# Altium project yampad_v2.PrjPcb
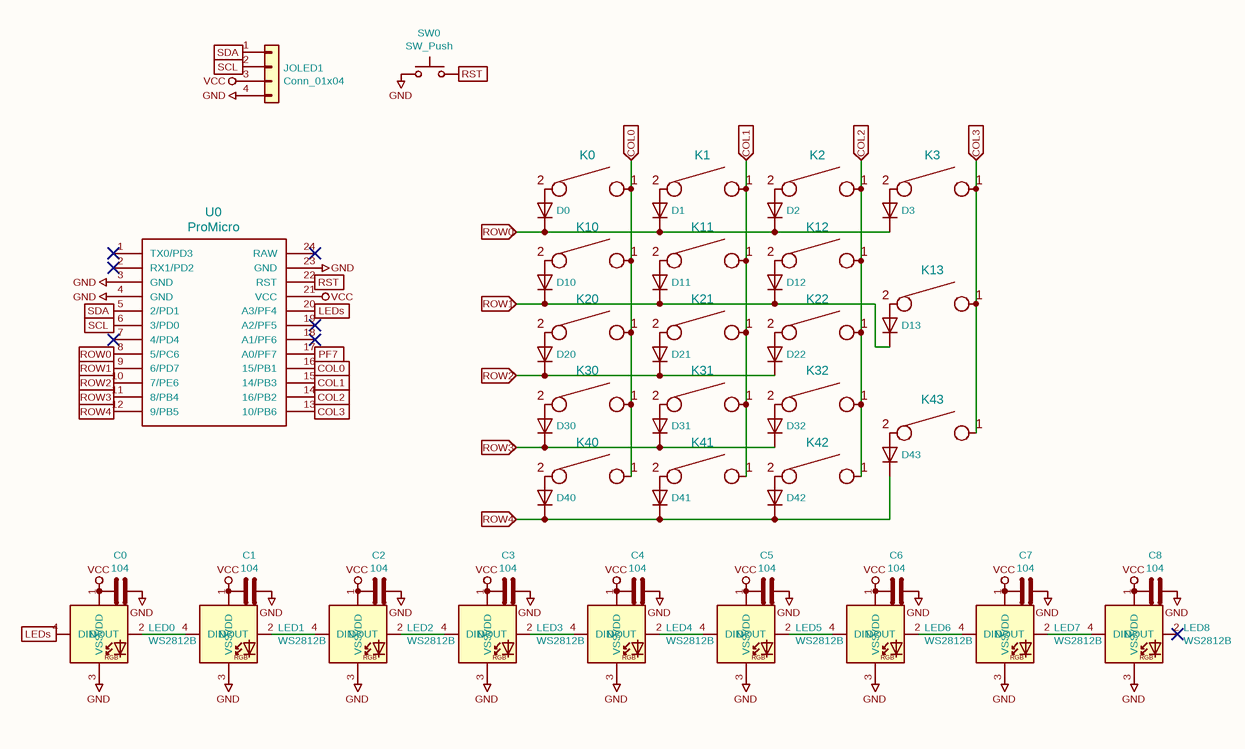
[diagram p0: yampad_v2.SchDoc]
1 sheet, 57 parts. Net scope: flat (ports and power ports of the same name join across sheets).
Board files: yampad_v2.PcbDoc, yampad_v2(1).PcbDoc

## Sheet yampad_v2.SchDoc
size 297 x 210 mm

### Parts
C0  104  [C_0805_2012Metric_Pad1.15x1.40mm_HandSolder]
C1  104  [C_0805_2012Metric_Pad1.15x1.40mm_HandSolder]
C2  104  [C_0805_2012Metric_Pad1.15x1.40mm_HandSolder]
C3  104  [C_0805_2012Metric_Pad1.15x1.40mm_HandSolder]
C4  104  [C_0805_2012Metric_Pad1.15x1.40mm_HandSolder]
C5  104  [C_0805_2012Metric_Pad1.15x1.40mm_HandSolder]
C6  104  [C_0805_2012Metric_Pad1.15x1.40mm_HandSolder]
C7  104  [C_0805_2012Metric_Pad1.15x1.40mm_HandSolder]
C8  104  [C_0805_2012Metric_Pad1.15x1.40mm_HandSolder]
D0  D  [D_SOD123_axial-dual]  (value not drawn)
D1  D  [D_SOD123_axial-dual]  (value not drawn)
D2  D  [D_SOD123_axial-dual]  (value not drawn)
D3  D  [D_SOD123_axial-dual]  (value not drawn)
D10  D  [D_SOD123_axial-dual]  (value not drawn)
D11  D  [D_SOD123_axial-dual]  (value not drawn)
D12  D  [D_SOD123_axial-dual]  (value not drawn)
D13  D  [D_SOD123_axial-dual]  (value not drawn)
D20  D  [D_SOD123_axial-dual]  (value not drawn)
D21  D  [D_SOD123_axial-dual]  (value not drawn)
D22  D  [D_SOD123_axial-dual]  (value not drawn)
D30  D  [D_SOD123_axial-dual]  (value not drawn)
D31  D  [D_SOD123_axial-dual]  (value not drawn)
D32  D  [D_SOD123_axial-dual]  (value not drawn)
D40  D  [D_SOD123_axial-dual]  (value not drawn)
D41  D  [D_SOD123_axial-dual]  (value not drawn)
D42  D  [D_SOD123_axial-dual]  (value not drawn)
D43  D  [D_SOD123_axial-dual]  (value not drawn)
JOLED1  Conn_01x04  [PinHeader_1x04_P2.54mm_Horizontal]
K0  KEYSW  [Kailh-PCB-Socket-1U-Cutout]  (value not drawn)
K1  KEYSW  [Kailh-PCB-Socket-1U-Cutout]  (value not drawn)
K2  KEYSW  [Kailh-PCB-Socket-1U-Cutout]  (value not drawn)
K3  KEYSW  [Kailh-PCB-Socket-1U-Cutout]  (value not drawn)
K10  KEYSW  [Kailh-PCB-Socket-1U-Cutout]  (value not drawn)
K11  KEYSW  [Kailh-PCB-Socket-1U-Cutout]  (value not drawn)
K12  KEYSW  [Kailh-PCB-Socket-1U-Cutout]  (value not drawn)
K13  KEYSW  [Kailh-PCB-Socket-1U-Cutout]  (value not drawn)
K20  KEYSW  [Kailh-PCB-Socket-1U-Cutout]  (value not drawn)
K21  KEYSW  [Kailh-PCB-Socket-1U-Cutout]  (value not drawn)
K22  KEYSW  [Kailh-PCB-Socket-1U-Cutout]  (value not drawn)
K30  KEYSW  [Kailh-PCB-Socket-1U-Cutout]  (value not drawn)
K31  KEYSW  [Kailh-PCB-Socket-1U-Cutout]  (value not drawn)
K32  KEYSW  [Kailh-PCB-Socket-1U-Cutout]  (value not drawn)
K40  KEYSW  [Kailh-PCB-Socket-1U-Cutout]  (value not drawn)
K41  KEYSW  [Kailh-PCB-Socket-1U-Cutout]  (value not drawn)
K42  KEYSW  [Kailh-PCB-Socket-1U-Cutout]  (value not drawn)
K43  KEYSW  [Kailh-PCB-Socket-1U-Cutout]  (value not drawn)
LED0  WS2812B  [LED_WS2812B_PLCC4_5.0x5.0mm_P3.2mm]
LED1  WS2812B  [LED_WS2812B_PLCC4_5.0x5.0mm_P3.2mm]
LED2  WS2812B  [LED_WS2812B_PLCC4_5.0x5.0mm_P3.2mm]
LED3  WS2812B  [LED_WS2812B_PLCC4_5.0x5.0mm_P3.2mm]
LED4  WS2812B  [LED_WS2812B_PLCC4_5.0x5.0mm_P3.2mm]
LED5  WS2812B  [LED_WS2812B_PLCC4_5.0x5.0mm_P3.2mm]
LED6  WS2812B  [LED_WS2812B_PLCC4_5.0x5.0mm_P3.2mm]
LED7  WS2812B  [LED_WS2812B_PLCC4_5.0x5.0mm_P3.2mm]
LED8  WS2812B  [LED_WS2812B_PLCC4_5.0x5.0mm_P3.2mm]
SW0  SW_Push  [SW_PUSH_6mm]
U0  ProMicro  [ArduinoProMicro]

### Ports
COL0 (in), COL1 (in), COL2 (in), COL3 (in), LEDs (in), PF7 (in), ROW0 (in), ROW1 (in), ROW2 (in), ROW3 (in), ROW4 (in), RST (in), SCL (in), SDA (in)

### Nets
GND: C0.1 C1.1 C2.1 C3.1 C4.1 C5.1 C6.1 C7.1 C8.1 JOLED1.4(Pin_4) LED0.3(VSS) LED1.3(VSS) LED2.3(VSS) LED3.3(VSS) LED4.3(VSS) LED5.3(VSS) LED6.3(VSS) LED7.3(VSS) LED8.3(VSS) SW0.1 U0.3(GND) U0.4(GND) U0.23(GND)
VCC: C0.2 C1.2 C2.2 C3.2 C4.2 C5.2 C6.2 C7.2 C8.2 JOLED1.3(Pin_3) LED0.1(VDD) LED1.1(VDD) LED2.1(VDD) LED3.1(VDD) LED4.1(VDD) LED5.1(VDD) LED6.1(VDD) LED7.1(VDD) LED8.1(VDD) U0.21(VCC)
COL0: K0.1 K10.1 K20.1 K30.1 K40.1 U0.16(15/PB1) ; port COL0
COL1: K1.1 K11.1 K21.1 K31.1 K41.1 U0.15(14/PB3) ; port COL1
COL2: K2.1 K12.1 K22.1 K32.1 K42.1 U0.14(16/PB2) ; port COL2
COL3: K3.1 K13.1 K43.1 U0.13(10/PB6) ; port COL3
LEDs: LED0.4(DIN) U0.20(A3/PF4) ; port LEDs
PF7: U0.17(A0/PF7) ; port PF7
ROW0: D0.1(K) D1.1(K) D2.1(K) D3.1(K) U0.8(5/PC6) ; port ROW0
ROW1: D10.1(K) D11.1(K) D12.1(K) D13.1(K) U0.9(6/PD7) ; port ROW1
ROW2: D20.1(K) D21.1(K) D22.1(K) U0.10(7/PE6) ; port ROW2
ROW3: D30.1(K) D31.1(K) D32.1(K) U0.11(8/PB4) ; port ROW3
ROW4: D40.1(K) D41.1(K) D42.1(K) D43.1(K) U0.12(9/PB5) ; port ROW4
RST: SW0.2 U0.22(RST) ; port RST
SCL: JOLED1.2(Pin_2) U0.6(3/PD0) ; port SCL
SDA: JOLED1.1(Pin_1) U0.5(2/PD1) ; port SDA
NetD0_2: D0.2(A) K0.2
NetD1_2: D1.2(A) K1.2
NetD2_2: D2.2(A) K2.2
NetD3_2: D3.2(A) K3.2
NetD10_2: D10.2(A) K10.2
NetD11_2: D11.2(A) K11.2
NetD12_2: D12.2(A) K12.2
NetD13_2: D13.2(A) K13.2
NetD20_2: D20.2(A) K20.2
NetD21_2: D21.2(A) K21.2
NetD22_2: D22.2(A) K22.2
NetD30_2: D30.2(A) K30.2
NetD31_2: D31.2(A) K31.2
NetD32_2: D32.2(A) K32.2
NetD40_2: D40.2(A) K40.2
NetD41_2: D41.2(A) K41.2
NetD42_2: D42.2(A) K42.2
NetD43_2: D43.2(A) K43.2
NetLED0_2: LED0.2(DOUT) LED1.4(DIN)
NetLED1_2: LED1.2(DOUT) LED2.4(DIN)
NetLED2_2: LED2.2(DOUT) LED3.4(DIN)
NetLED3_2: LED3.2(DOUT) LED4.4(DIN)
NetLED4_2: LED4.2(DOUT) LED5.4(DIN)
NetLED5_2: LED5.2(DOUT) LED6.4(DIN)
NetLED6_2: LED6.2(DOUT) LED7.4(DIN)
NetLED7_2: LED7.2(DOUT) LED8.4(DIN)

Not connected (* = marked no-connect by the designer): LED8 2(DOUT)*; U0 1(TX0/PD3)* 2(RX1/PD2)* 7(4/PD4)* 18(A1/PF6)* 19(A2/PF5)* 24(RAW)*

### Notes on the sheet
- 1
- 2
- 3
- 4
- 5
- 6
- A
- B
- C
- D
- Title: Yampad
- File: yampad_v2.sch
- Sheet: /
- Mattia Dal Ben
- KiCad E.D.A.  kicad (5.1.4)-1
- Size: A4
- Date: 2019-04-28
- Rev: 2.0
- Id: 1/1
- (in symbol WS2812B) RGB

### Library data of the parts
C0-C8 = C: Value: 104; Footprint: Capacitor_SMD:C_0805_2012Metric_Pad1.15x1.40mm_HandSolder
K0-K3 K10-K13 K20-K22 K30-K32 K40-K43 = KEYSW-canadian_parts: Value: KEYSW; Footprint: kailh-pcb-sockets:Kailh-PCB-Socket-1U-Cutout
U0 = ProMicro-keebio: Value: ProMicro; Footprint: Keebio-Parts:ArduinoProMicro
D0-D3 D10-D13 D20-D22 D30-D32 D40-D43 = D: Value: D; Footprint: canadian_footprints:D_SOD123_axial-dual
JOLED1 = Conn_01x04: Value: Conn_01x04; Footprint: Connector_PinHeader_2.54mm:PinHeader_1x04_P2.54mm_Horizontal
LED0-LED8 = WS2812B: Value: WS2812B; Footprint: LED_SMD:LED_WS2812B_PLCC4_5.0x5.0mm_P3.2mm
SW0 = SW_Push: Value: SW_Push; Footprint: Button_Switch_THT:SW_PUSH_6mm